# EAGLE design tx-unit (EAGLE 4.11)
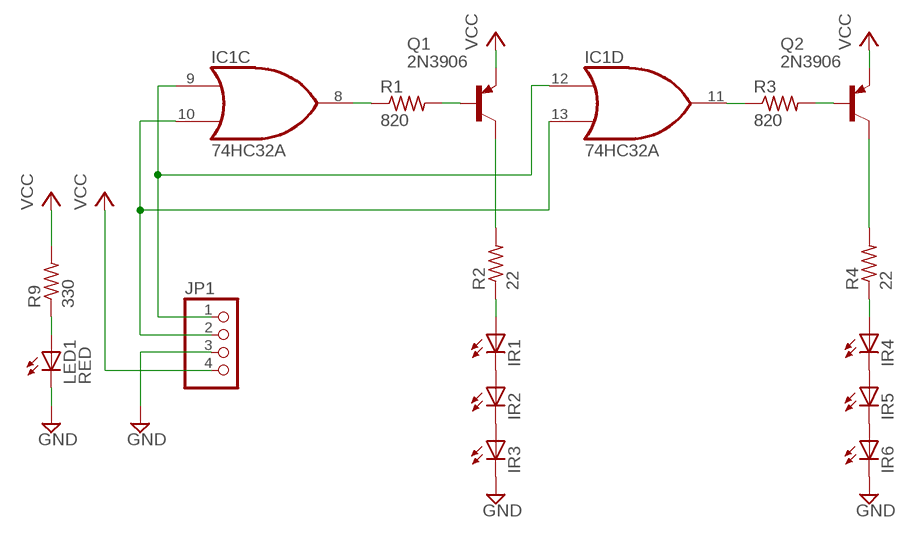
[diagram p0: schematic, sheet 1]

## Parts
IC1  74HC32A  74LS32N  [DIL14]
IR1  LED5MM  [LED5MM]
IR2  LED5MM  [LED5MM]
IR3  LED5MM  [LED5MM]
IR4  LED5MM  [LED5MM]
IR5  LED5MM  [LED5MM]
IR6  LED5MM  [LED5MM]
JP1  PINHD-1X4  [1X04]
LED1  RED  LED3MM  [LED3MM]
Q1  2N3906  [TO92]
Q2  2N3906  [TO92]
R1  820  R-US_0204/7  [0204/7]
R2  22  R-US_0204/7  [0204/7]
R3  820  R-US_0204/7  [0204/7]
R4  22  R-US_0204/7  [0204/7]
R9  330  R-US_0204/7  [0204/7]

## Nets
GND: IR3.K(C) IR6.K(C) JP1.3 LED1.K(C)
N$1: Q1.2(B) R1.2
N$2: IC1.8(C:O) R1.1
N$3: Q1.1(C) R2.2
N$4: IC1.11(D:O) R3.1
N$5: Q2.2(B) R3.2
N$6: Q2.1(C) R4.2
N$13: IR1.K(C) IR2.A
N$14: IR2.K(C) IR3.A
N$15: IR4.K(C) IR5.A
N$16: IR5.K(C) IR6.A
N$21: IR1.A R2.1
N$22: IR4.A R4.1
N$26: LED1.A R9.1
N$27: IC1.10(C:I1) IC1.13(D:I1) JP1.2
N$29: IC1.9(C:I0) IC1.12(D:I0) JP1.1
VCC: JP1.4 Q1.3(E) Q2.3(E) R9.2
Unconnected: IC1.1(A:I0) IC1.2(A:I1) IC1.3(A:O) IC1.4(B:I0) IC1.5(B:I1) IC1.6(B:O)

## Power pins joined to a net without a drawn wire
GND: IC1.7(P:GND)
VCC: IC1.14(P:VCC)

## Library data of the parts
IC1 = 74xx-us:74*32: Quad 2-input OR gate
IR1-IR6 LED1 = led:LED: LED OSRAM: - CHIPLED LG R971, LG N971, LY N971, LG Q971, LY Q971, LO R971, LY R971 LH N974, LH R974 LS Q976, LO Q976, LY Q976 LO Q996 - Hyper CHIPLED LW Q18S LB Q993, LB Q99A, LB R99A - SideLED LS A670, LO A670, LY A670, LG A670, LP A670 LB A673, LV A673, LT A673, LW A673 LH A674 LY A675 LS A676, LA A676, LO A676, LY A676, LW A676 LS A679, LY A679, LG A679 - Hyper Micro SIDELED® LS Y876, LA Y876, LO Y876, LY Y876 LT Y87S - SmartLED LW L88C, LW L88S LB L89C, LB L89S, LG L890 LS L89K, LO L89K, LY L89K LS L896, LA L896, LO L896, LY L896 - TOPLED LS T670, LO T670, LY T670, LG T670, LP T670 LSG T670, LSP T670, LSY T670, LOP T670, LYG T670 LG T671, LOG T671, LSG T671 LB T673, LV T673, LT T673, LW T673 LH T674 LS T676, LA T676, LO T676, LY T676, LB T676, LH T676, LSB T676, LW T676 LB T67C, LV T67C, LT T67C, LS T67K, LO T67K, LY T67K, LW E67C LS E67B, LA E67B, LO E67B, LY E67B, LB E67C, LV E67C, LT E67C LW T67C LS T679, LY T679, LG T679 LS T770, LO T770, LY T770, LG T770, LP T770 LB T773, LV T773, LT T773, LW T773 LH T774 LS E675, LA E675, LY E675, LS T675 LS T776, LA T776, LO T776, LY T776, LB T776 LHGB T686 LT T68C, LB T68C - Hyper Mini TOPLED® LB M676 - Mini TOPLED Santana® LG M470 LS M47K, LO M47K, LY M47K Source: http://www.osram.convergy.de/
JP1 = pinhead:PINHD-1X4: PIN HEADER
Q1 Q2 = transistor-pnp:2N3906: PNP Transistor
R1-R4 R9 = rcl:R-US_: RESISTOR, American symbol

## Board
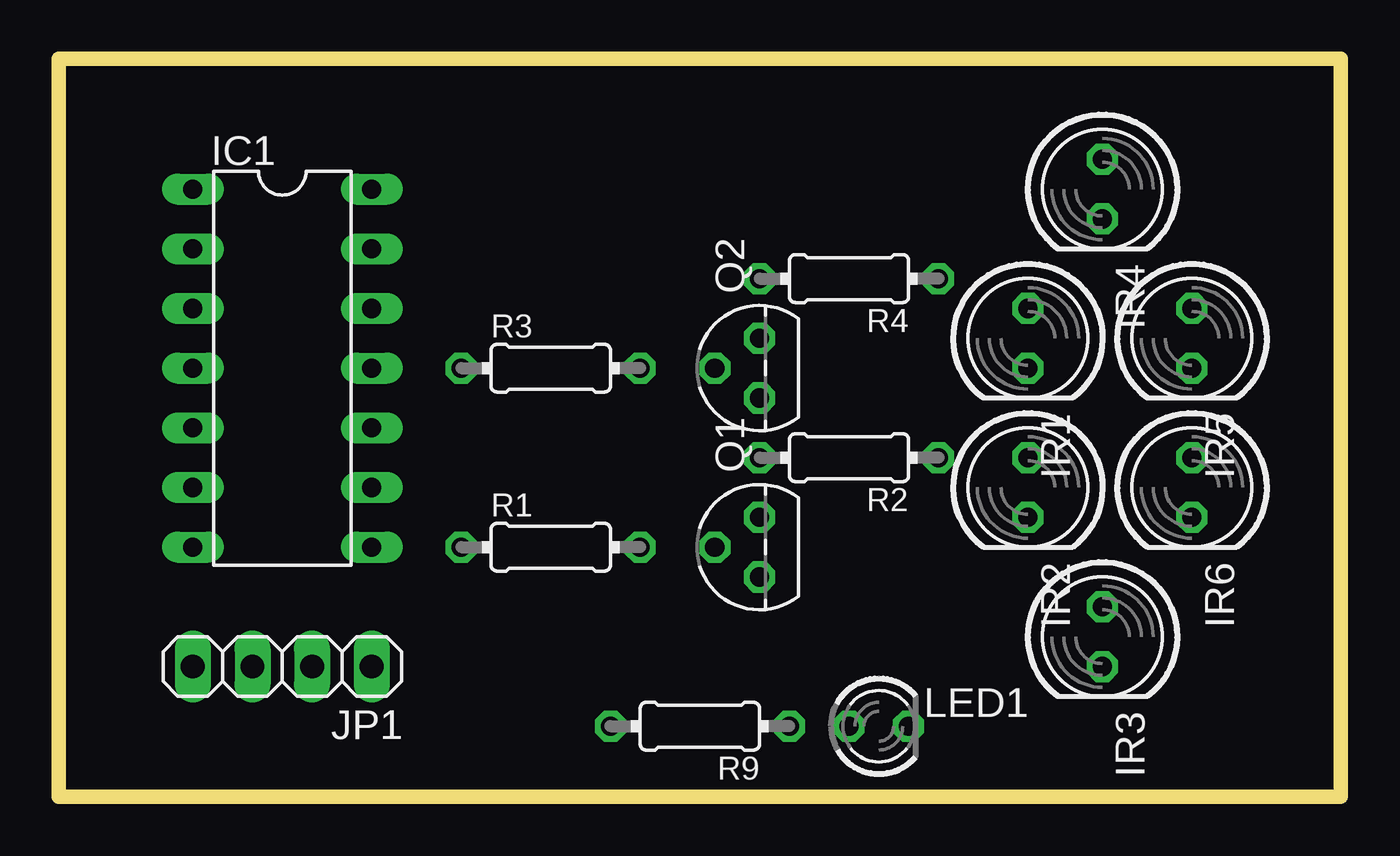
[diagram p1: board, top side]
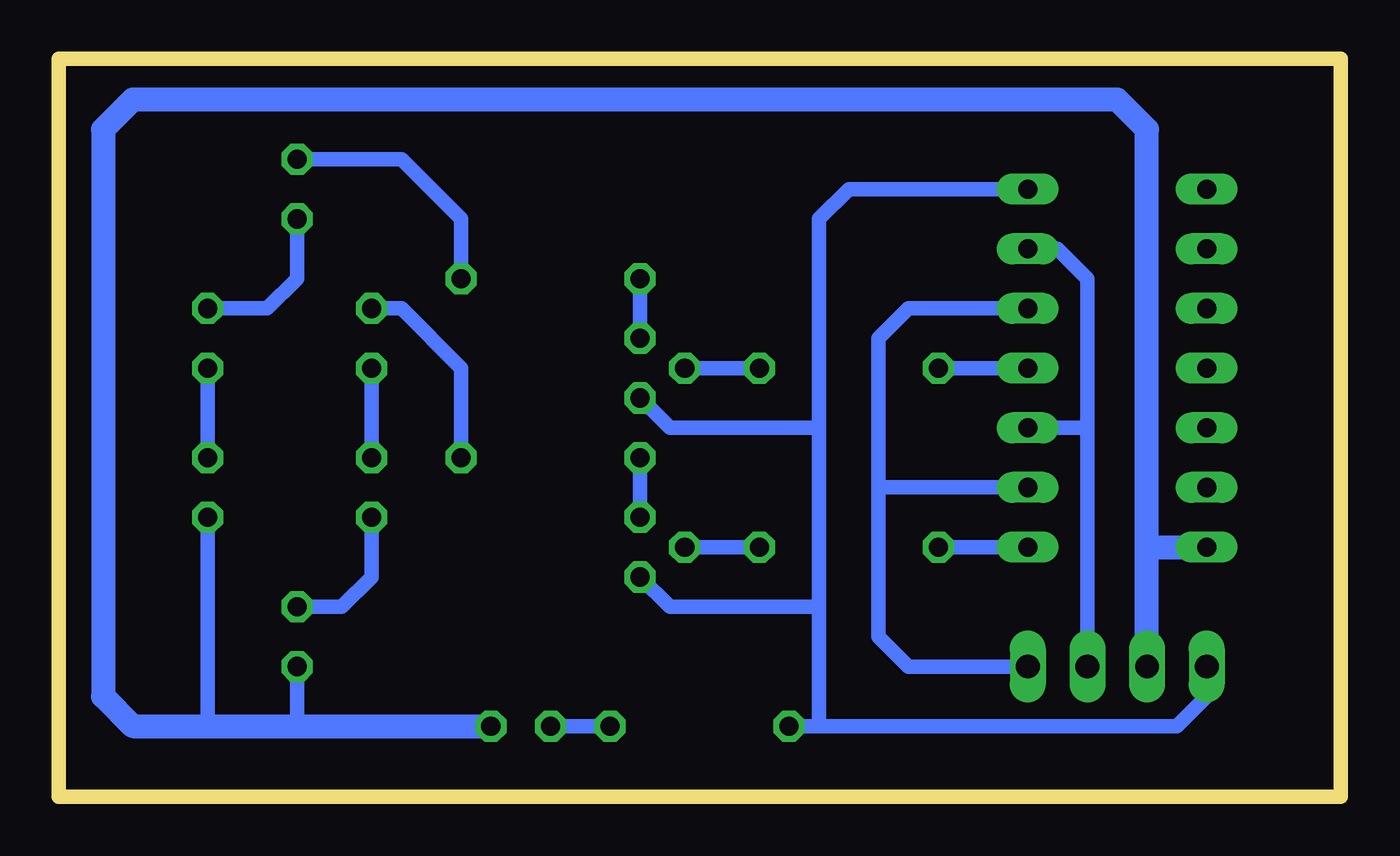
[diagram p2: board, bottom side, seen from below]

Size 54.59 x 31.42 mm. Coordinates in mm from the lower left corner, seen from the top.
Outline: 0,0 54.59,0 54.59,31.42 0,31.42 0,0
Copper layers (1*16): Top 0.035mm / dielectric 1.5mm / Bottom 0.035mm
Design rules "default": minimum track width 10mil, minimum drill 24mil, track to track 8mil, track to pad 8mil, pad to pad 8mil, via to via 8mil, smd to smd 8mil, copper to edge 40mil, drill to drill 8mil, minimum pad ring 10mil, minimum via ring 8mil, stop-mask expansion 4mil, vias tented up to drill 0mil, thermal gap 10mil

### Footprints (pad centres in the part's own frame; a part is rotated, then mirrored left to right if it is on the bottom)
DIL14 = drill 0.813 long: 1 -7.62,-3.81; 2 -5.08,-3.81; 3 -2.54,-3.81; 4 0,-3.81; 5 2.54,-3.81; 6 5.08,-3.81; 7 7.62,-3.81; 8 7.62,3.81; 9 5.08,3.81; 10 2.54,3.81; 11 0,3.81; 12 -2.54,3.81; 13 -5.08,3.81; 14 -7.62,3.81
LED5MM = drill 0.813 octagon: A -1.27,0; K 1.27,0
1X04 = drill 1.016 long: 1 -3.81,0; 2 -1.27,0; 3 1.27,0; 4 3.81,0
LED3MM = drill 0.813 octagon: A -1.27,0; K 1.27,0
TO92 = drill 0.813 octagon: 1 1.27,0; 2 0,1.905; 3 -1.27,0
0204/7 = drill 0.813 octagon: 1 -3.81,0; 2 3.81,0

### Placement (x,y rotation side)
IC1  9.52,18.25 270 top
IR1  41.27,19.52 270 top
IR2  41.27,13.17 270 top
IR3  44.45,6.82 270 top
IR4  44.45,25.87 270 top
IR5  48.26,19.52 270 top
IR6  48.26,13.17 270 top
JP1  9.52,5.55 180 top
LED1  34.92,3.01 0 top
Q1  29.84,10.63 90 top
Q2  29.84,18.25 90 top
R1  20.95,10.63 0 top
R2  33.65,14.44 180 top
R3  20.95,18.25 0 top
R4  33.65,22.06 180 top
R9  27.3,3.01 180 top

### Tracks (layer width: path | path; a pad name or v marks a point on that pad's centre or on a via)
GND
  Bottom 0.61: 44.45,3.01 IR3.K | 48.26,3.01 IR6.K
  Bottom 1.016: 8.25,10.63 IC1.7 | 8.25,10.63 8.25,28.41 9.52,29.68 51.43,29.68 52.7,28.41 52.7,4.28 51.43,3.01 48.26,3.01 44.45,3.01 LED1.K | JP1.3 8.25,10.63
N$1
  Bottom 0.61: R1.2 Q1.2
N$2
  Bottom 0.61: IC1.8 R1.1
N$3
  Bottom 0.61: Q1.1 R2.2
N$4
  Bottom 0.61: IC1.11 R3.1
N$5
  Bottom 0.61: R3.2 Q2.2
N$6
  Bottom 0.61: Q2.1 R4.2
N$13
  Bottom 0.61: IR1.K IR2.A
N$14
  Bottom 0.61: IR2.K 41.27,9.36 42.54,8.09 IR3.A
N$15
  Bottom 0.61: IR4.K 44.45,22.06 45.72,20.79 IR5.A
N$16
  Bottom 0.61: IR5.K IR6.A
N$21
  Bottom 0.61: R2.1 37.46,18.25 40,20.79 IR1.A
N$22
  Bottom 0.61: R4.1 37.46,24.6 40,27.14 IR4.A
N$26
  Bottom 0.61: R9.1 LED1.A
N$27
  Bottom 0.61: JP1.2 10.79,15.71 | 10.79,15.71 10.79,22.06 12.06,23.33 IC1.13 | 10.79,15.71 IC1.10
N$29
  Bottom 0.61: JP1.1 18.41,5.55 19.68,6.82 19.68,13.17 | 19.68,13.17 IC1.9 | 19.68,13.17 19.68,19.52 18.41,20.79 IC1.12
VCC
  Bottom 0.61: 22.22,3.01 R9.2 | 22.22,3.01 6.98,3.01 5.71,4.28 JP1.4 | IC1.14 20.95,25.87 22.22,24.6 22.22,15.71 | 22.22,3.01 22.22,8.09 | 22.22,8.09 22.22,15.71 | Q2.3 28.57,15.71 22.22,15.71 | 22.22,8.09 28.57,8.09 Q1.3